# EAGLE design rev1 (EAGLE 9.5.1)
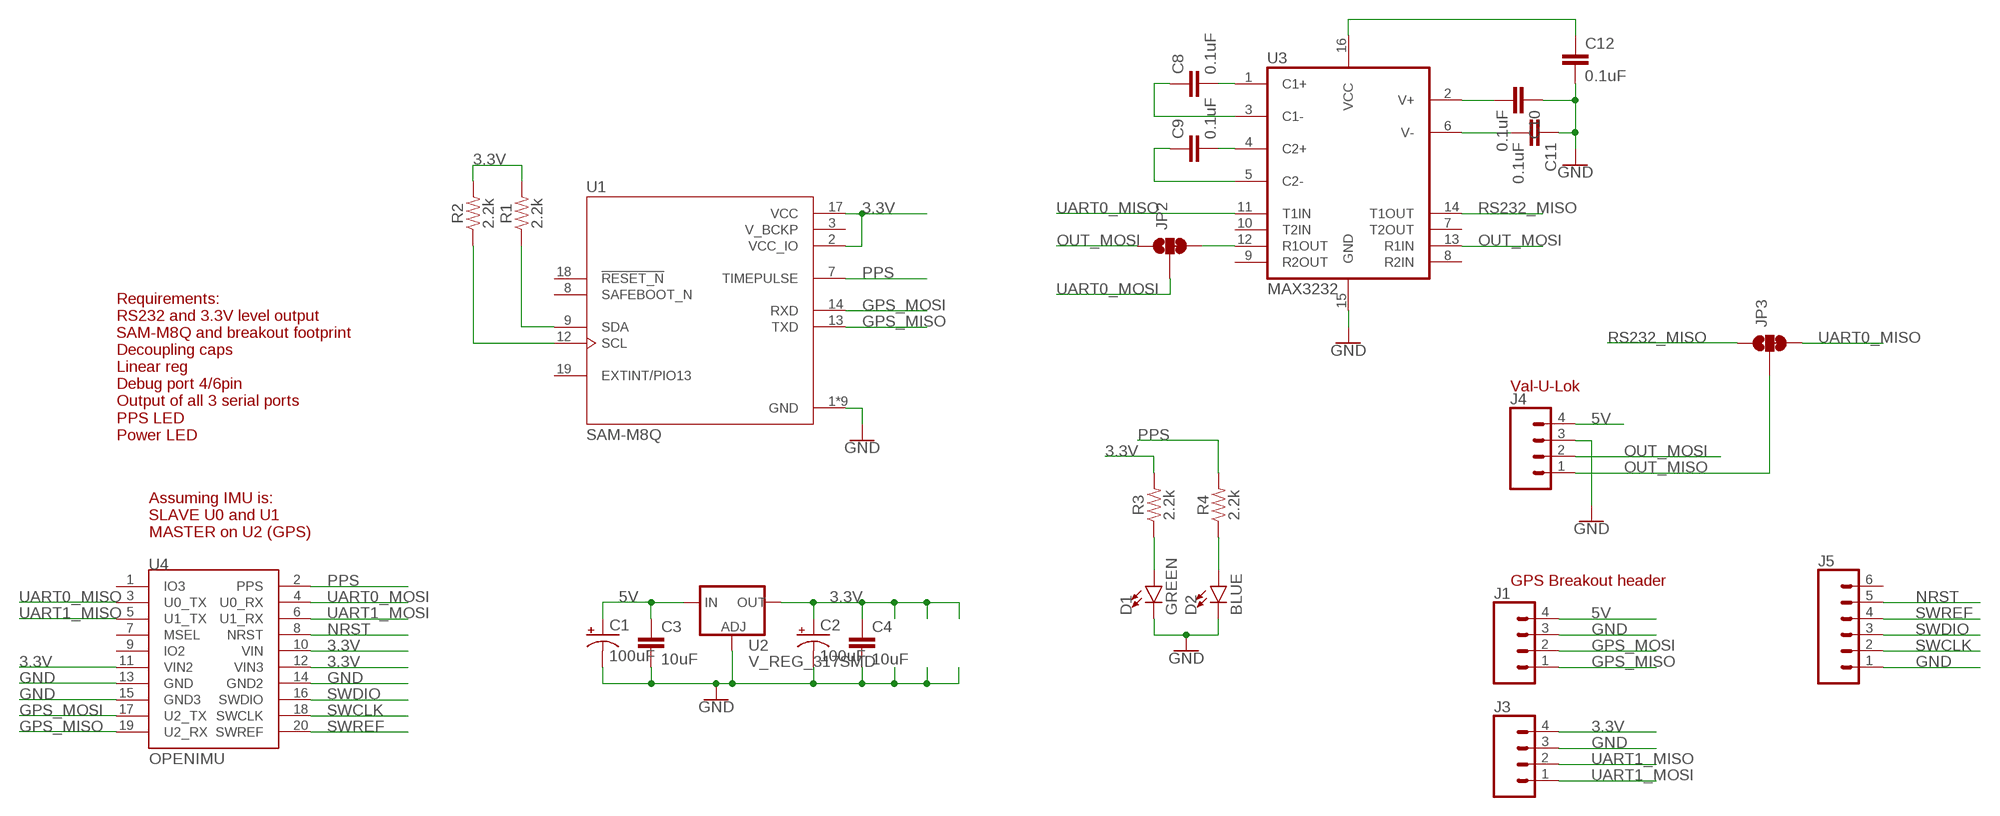
[diagram p0: schematic, sheet 1]

## Parts
C1  100uF  47UF-POLAR-EIA3528-10V-10%  [EIA3528]
C2  100uF  47UF-POLAR-EIA3528-10V-10%  [EIA3528]
C3  10uF  10UF-0805-10V-10%  [0805]
C4  10uF  10UF-0805-10V-10%  [0805]
C8  0.1uF  0.1UF-0603-25V-5%  [0603]
C9  0.1uF  0.1UF-0603-25V-5%  [0603]
C10  0.1uF  0.1UF-0603-25V-5%  [0603]
C11  0.1uF  0.1UF-0603-25V-5%  [0603]
C12  0.1uF  0.1UF-0603-25V-5%  [0603]
D1  GREEN  LED-GREEN0603  [LED-0603]
D2  BLUE  LED-BLUE0603  [LED-0603]
J1  CONN_04  [1X04]
J3  CONN_04  [1X04]
J4  CONN_04POLAR  [MOLEX-1X4]
J5  CONN_06POLAR  [MOLEX-1X6]
JP2  JUMPER-SMT_3_1-NC_TRACE_SILK  [SMT-JUMPER_3_1-NC_TRACE_SILK]
JP3  JUMPER-SMT_3_1-NC_TRACE_SILK  [SMT-JUMPER_3_1-NC_TRACE_SILK]
R1  2.2k  2.2KOHM-0603-1/10W-1%  [0603]
R2  2.2k  2.2KOHM-0603-1/10W-1%  [0603]
R3  2.2k  2.2KOHM-0603-1/10W-1%  [0603]
R4  2.2k  2.2KOHM-0603-1/10W-1%  [0603]
U1  SAM-M8Q  [XCVR_SAM-M8Q]
U2  V_REG_317SMD  [SOT223]
U3  MAX3232  MAX2323TSSOP  [TSSOP16]
U4  OPENIMU  [OPENIMU300ZA]

## Nets
3.3V: C2.A(+) C4.1 J3.4 R1.2 R2.2 R3.2 U1.2(VCC_IO) U1.17(VCC) U2.2(OUT) U4.10(VIN) U4.11(VIN2) U4.12(VIN3)
5V: C1.A(+) C3.1 J1.4 J4.4 U2.3(IN)
GND: C1.C(-) C2.C(-) C3.2 C4.2 C10.1 C11.1 C12.2 D1.C D2.C J1.3 J3.3 J4.3 J5.1 U1.1(GND) U1.4(GND) U1.5(GND) U1.6(GND) U1.10(GND) U1.11(GND) U1.15(GND) U1.16(GND) U1.20(GND) U2.1(ADJ) U3.15(GND) U4.13(GND) U4.14(GND2) U4.15(GND3)
GPS_MISO: J1.1 U1.13(TXD) U4.19(U2_RX)
GPS_MOSI: J1.2 U1.14(RXD) U4.17(U2_TX)
N$1: R1.1 U1.9(SDA)
N$2: R2.1 U1.12(SCL)
N$3: C8.2 U3.1(C1+)
N$4: D1.A R3.1
N$5: C8.1 U3.3(C1-)
N$6: D2.A R4.1
N$7: C9.2 U3.4(C2+)
N$8: C9.1 U3.5(C2-)
N$9: C11.2 U3.6(V-)
N$10: C10.2 U3.2(V+)
N$11: C12.1 U3.16(VCC)
N$15: JP2.3 U3.12(R1OUT)
NRST: J5.5 U4.8(NRST)
OUT_MISO: J4.1 JP3.2
OUT_MOSI: J4.2 JP2.1 U3.13(R1IN)
PPS: R4.2 U1.7(TIMEPULSE) U4.2(PPS)
RS232_MISO: JP3.1 U3.14(T1OUT)
SWCLK: J5.2 U4.18(SWCLK)
SWDIO: J5.3 U4.16(SWDIO)
SWREF: J5.4 U4.20(SWREF)
UART0_MISO: JP3.3 U3.11(T1IN) U4.3(U0_TX)
UART0_MOSI: JP2.2 U4.4(U0_RX)
UART1_MISO: J3.2 U4.5(U1_TX)
UART1_MOSI: J3.1 U4.6(U1_RX)
Unconnected: J5.6 U1.8(SAFEBOOT_N) U1.18(!RESET_N) U1.19(EXTINT/PIO13) U3.7(T2OUT) U3.8(R2IN) U3.9(R2OUT) U3.10(T2IN) U4.1(IO3) U4.7(MSEL) U4.9(IO2)

## Notes on the sheet
- Val-U-Lok
- Requirements:
  RS232 and 3.3V level output
  SAM-M8Q and breakout footprint
  Decoupling caps
  Linear reg
  Debug port 4/6pin
  Output of all 3 serial ports
  PPS LED
  Power LED
- Assuming IMU is:
  SLAVE U0 and U1
  MASTER on U2 (GPS)
- GPS Breakout header

## Power pins joined to a net without a drawn wire
V_BCKP: U1.3(V_BCKP)

## Library data of the parts
C1 C2 = SparkFun-Capacitors:47UF-POLAR: 47µF polarized capacitors A capacitor is a passive two-terminal electrical component used to store electrical energy temporarily in an electric field.; PROD_ID: CAP-08310; VALUE: 47uF
C3 C4 = SparkFun-Capacitors:10UF: 10.0µF ceramic capacitors A capacitor is a passive two-terminal electrical component used to store electrical energy temporarily in an electric field.; PROD_ID: CAP-11330
C8-C12 = SparkFun-Capacitors:0.1UF: 0.1µF ceramic capacitors A capacitor is a passive two-terminal electrical component used to store electrical energy temporarily in an electric field.; PROD_ID: CAP-08604
D1 = SparkFun-LED:LED-GREEN: Green SMD LED Used in manufacturing of various products at SparkFun Packages: 0603 - SMD 0603 package [Product Link] <http://www.futureelectronics.com/en/technologies/semiconductors/optoelectronics/leds/Pages/9894312-LTST-C190GKT.aspx?CrossPart=HSMG-C190&IM=0> LilyPad 1206 - SMD1206 LilyPad package [Product Link] <http://www.futureelectronics.com/en/Technologies/Product.aspx?ProductID=IN150NGHARVATEKCORPORATION2049943&IM=0> 1206 - SMD1206 package [Product Link] <http://www.futureelectronics.com/en/technologies/semiconductors/optoelectronics/leds/Pages/8315665-LTST-C150KGKT.aspx?IM=0> 1206 Bottom Mount -SMD 1206 Bottom Mount [Product Link] <http://www.digikey.com/product-detail/en/lite-on-inc/LTST-C230KGKT/160-1456-1-ND/386854> SparkFun Products: Pro Mini 328 -5V <https://www.sparkfun.com/products/821> RedBoard <https://www.sparkfun.com/products/12757> MP3 Trigger <https://www.sparkfun.com/products/13720> Makey Makey <https://www.sparkfun.com/products/11076>; PROD_ID: DIO-00821
D2 = SparkFun-LED:LED-BLUE: Blue SMD LED Used in manufacturing of various products at SparkFun Packages: 0603 - SMD 0603 package [Product Link] <http://www.digikey.com/product-detail/en/SMLE12BC7TT86/511-1589-2-ND/1641808> 1206 - SMD1206 package [Product Link] <http://www.digikey.com/product-detail/en/lite-on-inc/LTST-C150TBKT/160-1643-1-ND/573584> SparkFun Products: ESP8266 Thing-Dev Board <https://www.sparkfun.com/products/13711> RedBoard <https://www.sparkfun.com/products/12757>; PROD_ID: DIO-08575
J1 J3 = SparkFun-Connectors:CONN_04: Multi connection point. Often used as Generic Header-pin footprint for 0.1 inch spaced/style header connections On any of the 0.1 inch spaced packages, you can populate with these: Break Away Headers - Straight <https://www.sparkfun.com/products/116> (PRT-00116) Break Away Male Headers - Right Angle <https://www.sparkfun.com/products/553> (PRT-00553) Female Headers <https://www.sparkfun.com/products/115> (PRT-00115) Break Away Headers - Machine Pin <https://www.sparkfun.com/products/117> (PRT-00117) Break Away Female Headers - Swiss Machine Pin <https://www.sparkfun.com/products/743> (PRT-00743) For SCREWTERMINALS and SPRING TERMINALS visit here: Screw Terimnals on SparkFun.com <https://www.sparkfun.com/search/results?term=Screw+Terminals> (5mm/3.5mm/2.54mm spacing) This device is also useful as a general connection point to wire up your design to another part of your project. Our various solder wires solder well into these plated through hole pads. Hook-Up Wire - Assortment (Stranded, 22 AWG) <https://www.sparkfun.com/products/11375> (PRT-11375) Hook-Up Wire - Assortment (Solid Core, 22 AWG) <https://www.sparkfun.com/products/11367> (PRT-11367) View the entire wire category on our website here <https://www.sparkfun.com/categories/141> Special notes: Molex polarized connector foot print use with SKU : PRT-08231 with associated crimp pins and housings. 1MM SMD Version SKU: PRT-10208; PROD_ID: CONN-09696
J4 = SparkFun-Connectors:CONN_04: Multi connection point. Often used as Generic Header-pin footprint for 0.1 inch spaced/style header connections On any of the 0.1 inch spaced packages, you can populate with these: Break Away Headers - Straight <https://www.sparkfun.com/products/116> (PRT-00116) Break Away Male Headers - Right Angle <https://www.sparkfun.com/products/553> (PRT-00553) Female Headers <https://www.sparkfun.com/products/115> (PRT-00115) Break Away Headers - Machine Pin <https://www.sparkfun.com/products/117> (PRT-00117) Break Away Female Headers - Swiss Machine Pin <https://www.sparkfun.com/products/743> (PRT-00743) For SCREWTERMINALS and SPRING TERMINALS visit here: Screw Terimnals on SparkFun.com <https://www.sparkfun.com/search/results?term=Screw+Terminals> (5mm/3.5mm/2.54mm spacing) This device is also useful as a general connection point to wire up your design to another part of your project. Our various solder wires solder well into these plated through hole pads. Hook-Up Wire - Assortment (Stranded, 22 AWG) <https://www.sparkfun.com/products/11375> (PRT-11375) Hook-Up Wire - Assortment (Solid Core, 22 AWG) <https://www.sparkfun.com/products/11367> (PRT-11367) View the entire wire category on our website here <https://www.sparkfun.com/categories/141> Special notes: Molex polarized connector foot print use with SKU : PRT-08231 with associated crimp pins and housings. 1MM SMD Version SKU: PRT-10208; PROD_ID: CONN-08186; SF_ID: PRT-08231
J5 = SparkFun-Connectors:CONN_06: Multi connection point. Often used as Generic Header-pin footprint for 0.1 inch spaced/style header connections On any of the 0.1 inch spaced packages, you can populate with these: Break Away Headers - Straight <https://www.sparkfun.com/products/116> (PRT-00116) Break Away Male Headers - Right Angle <https://www.sparkfun.com/products/553> (PRT-00553) Female Headers <https://www.sparkfun.com/products/115> (PRT-00115) Break Away Headers - Machine Pin <https://www.sparkfun.com/products/117> (PRT-00117) Break Away Female Headers - Swiss Machine Pin <https://www.sparkfun.com/products/743> (PRT-00743) Arduino Stackable Header - 6 Pin <https://www.sparkfun.com/products/9280> (PRT-09280) For SCREWTERMINALS and SPRING TERMINALS visit here: Screw Terimnals on SparkFun.com <https://www.sparkfun.com/search/results?term=Screw+Terminals> (5mm/3.5mm/2.54mm spacing) This device is also useful as a general connection point to wire up your design to another part of your project. Our various solder wires solder well into these plated through hole pads. Hook-Up Wire - Assortment (Stranded, 22 AWG) <https://www.sparkfun.com/products/11375> (PRT-11375) Hook-Up Wire - Assortment (Solid Core, 22 AWG) <https://www.sparkfun.com/products/11367> (PRT-11367) View the entire wire category on our website here <https://www.sparkfun.com/categories/141>
JP2 JP3 = SparkFun-Jumpers:JUMPER-SMT_3_1-NC_TRACE: Normally closed trace jumper (1 of 2 connections) This jumper has a trace between two pads so it's normally closed (NC). The other connection is normally open (NO). Use a razor knife to open the connection. For best results follow the IPC guidelines for cutting traces: Cutout at least 0.063 mm (0.005 in). Remove all loose material to clean up the cut area. Seal the cut with an approved epoxy. Reapply solder to reclose the connection, or to close the NO connection.
R1-R4 = SparkFun-Resistors:2.2KOHM: 2.2kΩ resistor A resistor is a passive two-terminal electrical component that implements electrical resistance as a circuit element. Resistors act to reduce current flow, and, at the same time, act to lower voltage levels within circuits. - Wikipedia; PROD_ID: RES-08272
U1 = SAM-M8Q:SAM-M8Q: u-blox SAM GNSS antenna module; AVAILABILITY: Unavailable; DESCRIPTION: SAM-M8Q RF Receiver Galileo, GLONASS, GPS 1.575GHz, 1.602GHz -165dBm 400kbps; MF: U-Blox America; MP: SAM-M8Q; PACKAGE: SMD-20 U-Blox America; PRICE: None
U2 = SparkFun-IC-Power:V_REG_317: Voltage Regulator Standard LM317 adjustable voltage regulator. AOI (Adjust Output Input). Google 'LM317 Calculator' for easy to use app to get the two resistor values needed. 240/720 for 5V output. 240/390 for 3.3V output. Spark Fun Electronics SKU : COM-00527
U3 = SparkFun-IC-Comms:MAX2323: RS232 Transceiver This part covers 232 drivers that are compatible with the MAX3232. Sipex SP3232EB Datasheet <http://cdn.sparkfun.com/datasheets/Components/General%20IC/SP3232EBCA-L.pdf> SparkFun Products SOIC component <https://www.sparkfun.com/products/589> (COM-00589 / IC-08171) Retired DIP component (COM-00316 / IC-08446) SparkFun Transceiver Breakout - MAX3232 <https://www.sparkfun.com/products/11189> (BOB-11189) SparkFun XBee Explorer Serial <https://www.sparkfun.com/products/13225> (WRL-13225); PROD_ID: NA-XXXXX
U4 = 2020:OPENIMU

## Board
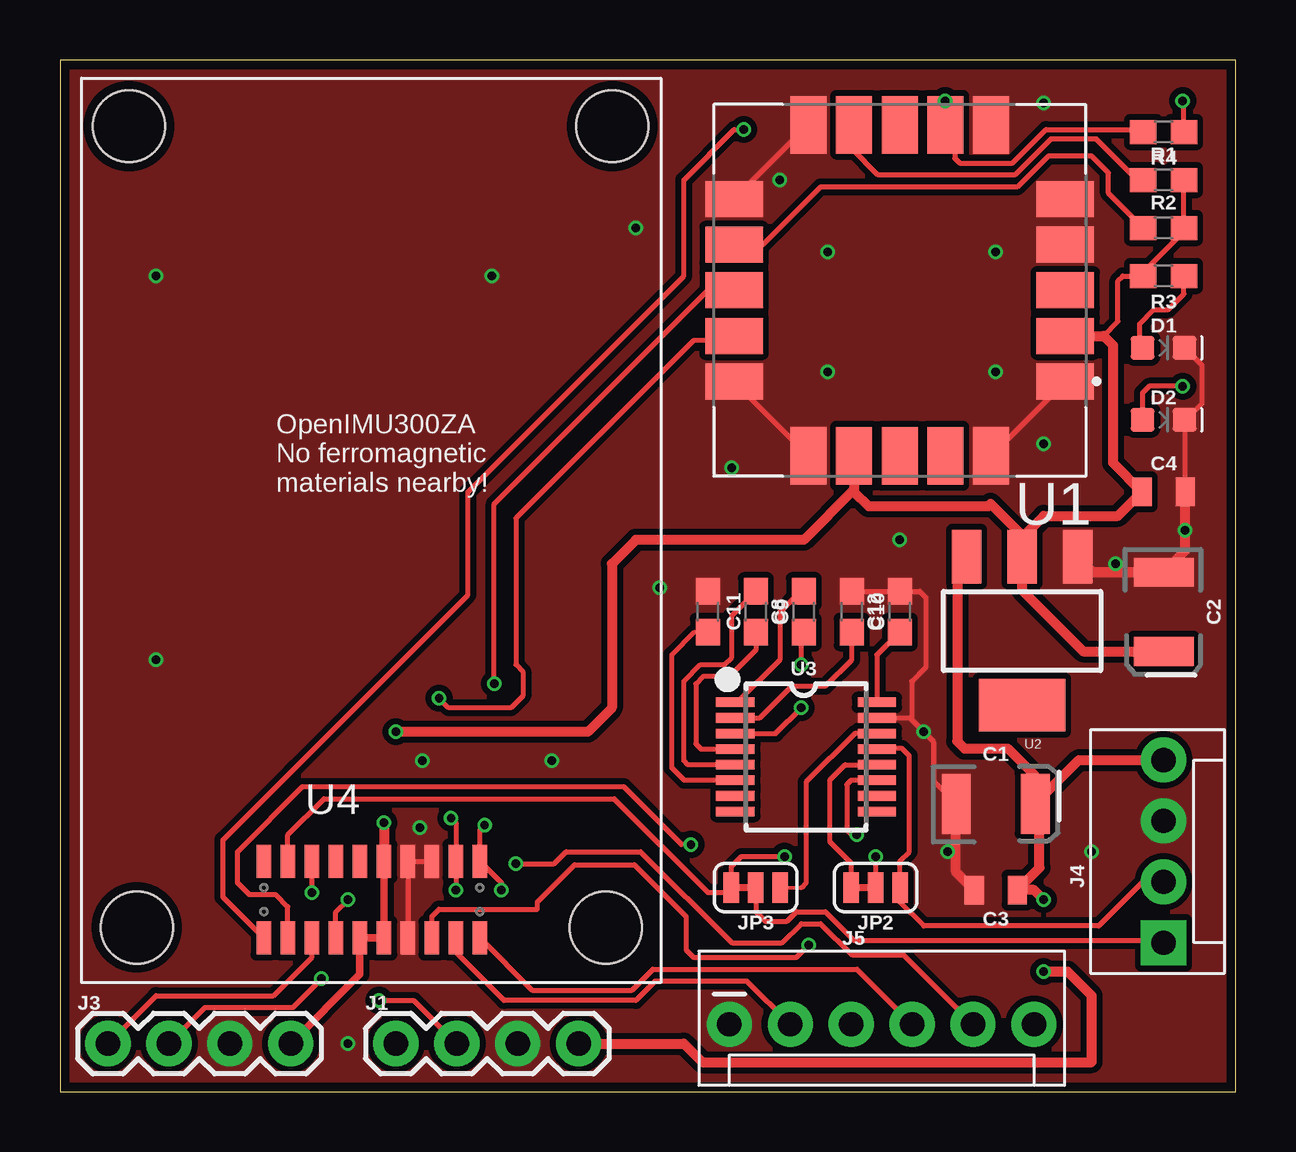
[diagram p1: board, top side]
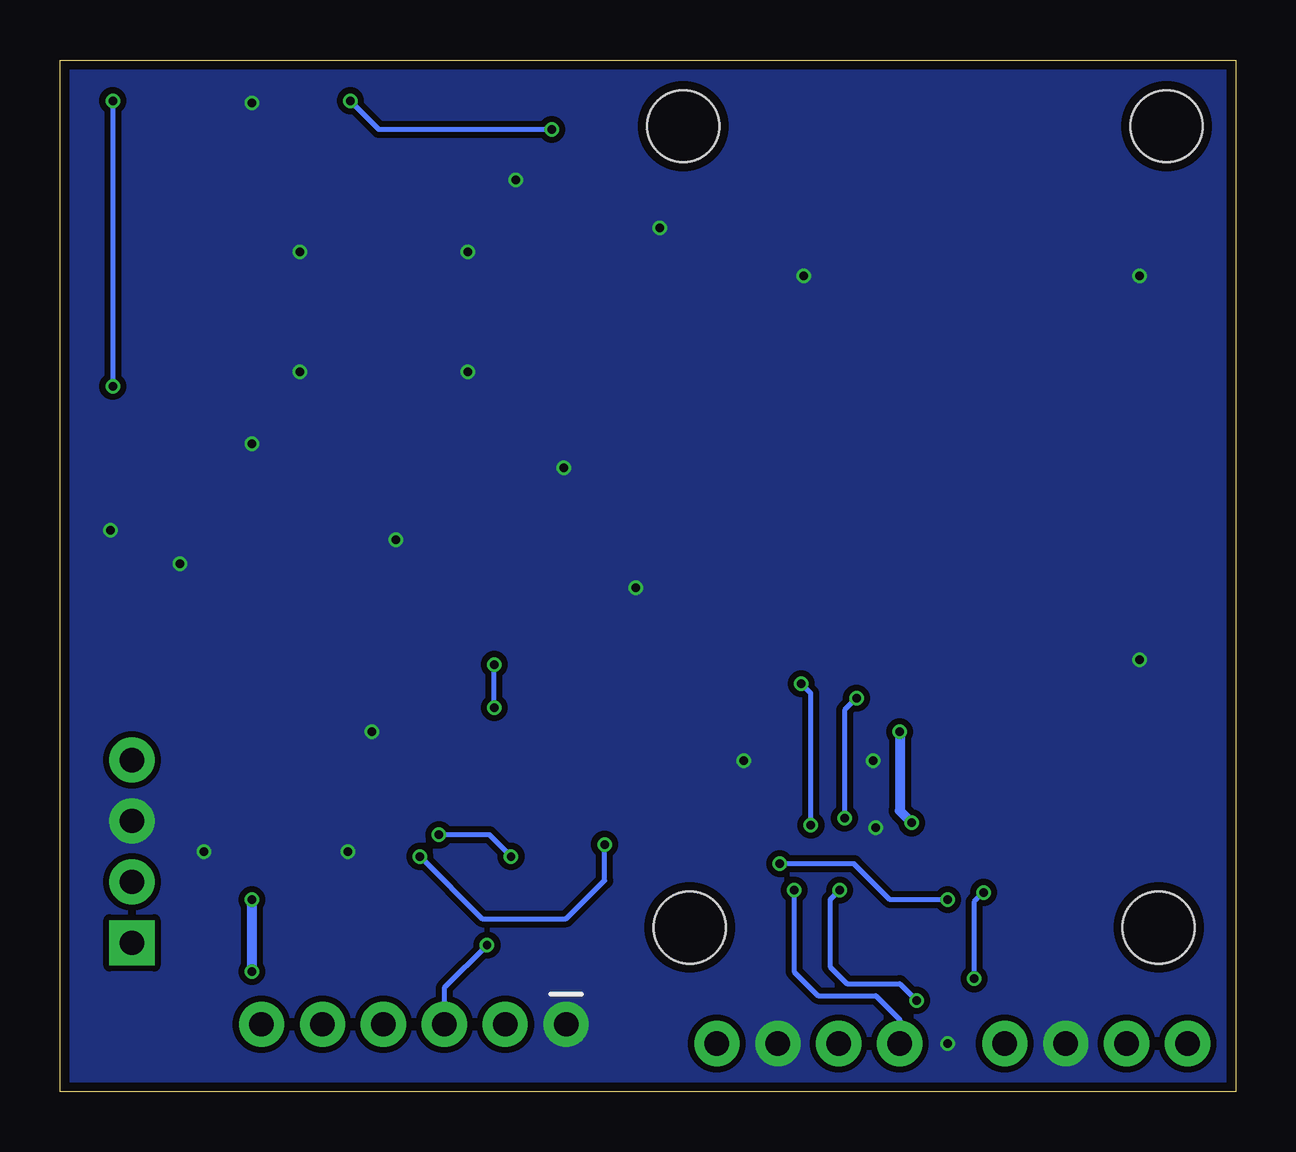
[diagram p2: board, bottom side, seen from below]

Size 49 x 43 mm. Coordinates in mm from the lower left corner, seen from the top.
Outline: 0,0 49,0 49,43 0,43 0,0
Copper layers (1*16): Top 0.035559375mm / dielectric 1.6mm / Bottom 0.035559375mm
Design rules "PATRICK-2lyr": minimum track width 6mil, minimum drill 10mil, track to track 6mil, track to pad 6mil, pad to pad 6mil, via to via 6mil, smd to smd 6mil, copper to edge 15mil, drill to drill 6mil, minimum pad ring 5mil, minimum via ring 5mil, stop-mask expansion 2.5mil, vias tented up to drill 25mil, thermal gap 10mil

### Footprints (pad centres in the part's own frame; a part is rotated, then mirrored left to right if it is on the bottom)
EIA3528 = smd 1.2 x 2.5: A 1.65,0; C -1.65,0
0805 = smd 0.8 x 1.2: 1 -0.9,0; 2 0.9,0
0603 = smd 1.1 x 1: 1 -0.85,0; 2 0.85,0
LED-0603 = smd 1 x 1: A -0.877,0; C 0.877,0
1X04 = drill 1.016 pad 1.88: 1 0,0; 2 2.54,0; 3 5.08,0; 4 7.62,0
MOLEX-1X4 = drill 1.016 pad 1.88 square: 1 0,0 | drill 1.016 pad 1.88: 2 2.54,0; 3 5.08,0; 4 7.62,0
MOLEX-1X6 = drill 1.016 pad 1.88: 1 0,0; 2 2.54,0; 3 5.08,0; 4 7.62,0; 5 10.16,0; 6 12.7,0
SMT-JUMPER_3_1-NC_TRACE_SILK = smd 0.635 x 1.27: 1 -1.016,0; 2 0,0; 3 1.016,0
XCVR_SAM-M8Q = smd 2.4 x 1.5: 1 -6.9,3.8; 2 -6.9,1.9; 3 -6.9,0; 4 -6.9,-1.9; 5 -6.9,-3.8; 11 6.9,-3.8; 12 6.9,-1.9; 13 6.9,0; 14 6.9,1.9; 15 6.9,3.8 | smd 1.5 x 2.4: 6 -3.8,-6.9; 7 -1.9,-6.9; 8 0,-6.9; 9 1.9,-6.9; 10 3.8,-6.9; 16 3.8,6.9; 17 1.9,6.9; 18 0,6.9; 19 -1.9,6.9; 20 -3.8,6.9
SOT223 = smd 1.219 x 2.235: 1 -2.311,-3.099; 2 0,-3.099; 3 2.311,-3.099 | smd 3.6 x 2.2: 4 0,3.099
TSSOP16 = smd 0.4 x 1.6: 1 -2.225,-2.85; 2 -1.575,-2.85; 3 -0.925,-2.85; 4 -0.275,-2.85; 5 0.375,-2.85; 6 1.025,-2.85; 7 1.675,-2.85; 8 2.325,-2.85; 9 2.325,3.05; 10 1.675,3.05; 11 1.025,3.05; 12 0.375,3.05; 13 -0.275,3.05; 14 -0.925,3.05; 15 -1.575,3.05; 16 -2.225,3.05
OPENIMU300ZA = smd 0.61 x 1.372: 1 -4.503,1.6; 2 -4.503,-1.6; 3 -3.503,1.6; 4 -3.503,-1.6; 5 -2.502,1.6; 6 -2.502,-1.6; 7 -1.501,1.6; 8 -1.501,-1.6; 9 -0.5,1.6; 10 -0.5,-1.6; 11 0.5,1.6; 12 0.5,-1.6; 13 1.501,1.6; 14 1.501,-1.6; 15 2.502,1.6; 16 2.502,-1.6; 17 3.503,1.6; 18 3.503,-1.6; 19 4.503,1.6; 20 4.503,-1.6 | hole 3: 9.75,-1.16; -9.8,-1.16; -10.125,32.24; 10.025,32.24

### Placement (x,y rotation side)
C1  39,12 0 top
C2  46,20 270 top
C3  39,8.4 180 top
C4  46,25 0 top
C8  31,20 90 top
C9  29,20 270 top
C10  33,20 270 top
C11  27,20 270 top
C12  35,20 90 top
D1  46,31 0 top
D2  46,28 0 top
J1  14,2 0 top
J3  2,2 0 top
J4  46,6.2 90 top
J5  27.9,2.8 0 top
JP2  34,8.5 180 top
JP3  29,8.5 180 top
R1  46,38 0 top
R2  46,36 0 top
R3  46,34 180 top
R4  46,40 180 top
U1  35,33.4 180 top
U2  40.1,19.2 180 top
U3  31,14 270 top
U4  13,8 0 top

### Tracks (layer width: path | path; a pad name or v marks a point on that pad's centre or on a via)
3.3V  (via drill 0.35)
  Top 0.203: 43.5,31.5 44.1,32.1 44.1,33.8 44.3,34 R3.2 45.15,34.15 46.85,35.85 R2.2 R1.2
  Top 0.305: U4.11 U4.12 U4.10 12.5,4.88 J3.4
  Top 0.406: U2.2 40.1,20.9 42.65,18.35 C2.A | U2.2 40.1,23.1 41,24 44.1,24 C4.1 43.9,26.2 43.9,31.1 43.5,31.5 U1.2 | U2.2 40.1,23.2 38.8,24.5 38.7,24.4 33.7,24.4 33.1,25 U1.17 33.1,25.1 31,23 24,23 23,22 23,16 22,15 v14,15 | v13.5,11.2 | v13.5,11.2 U4.11
  Bottom 0.406: v14,15 14,11.7 v13.5,11.2
5V  (via drill 0.35)
  Top 0.406: 40.83,12.18 C1.A 40.65,13.15 39.5,14.3 37.7,14.3 37.4,14.6 37.4,21.91 U2.3 | 40.83,12.18 42.47,13.82 J4.4 | 40.83,12.18 40.83,9.32 C3.1 40.6,8.4 v41,8 | J1.4 26,2 26.78,1.22 43,1.22 43,4 42,5 v41,5
  Bottom 0.406: v41,5 v41,8
GND  (via drill 0.35)
  Top 0.203: U4.14 U4.13 U4.15 | C10.1 C12.2 35.85,20.85 36.1,20.6 36.1,17.7 35.5,17.1 35.5,15.5 | U3.15 35.42,15.57 35.5,15.5 | C1.C 36.4,12.95 36.4,14.6 v36,15 35.5,15.5 | C4.2 46.9,27.98 | 46.9,27.98 D2.C | D1.C 47.6,30.28 47.6,28.68 46.9,27.98 | U1.11 U1.10 | U1.15 U1.16 | U1.20 U1.1
  Top 0.406: C3.2 37.35,9.15 C1.C | C4.2 v46.9,23.4 46.9,22.55 C2.C 43.06,21.65 U2.1
  other vias: 28,26 32,30 32,35 39,35 39,30 41,27 41,41.2 24,36 30,38 35,23 25,21 37,10 43,10 44,22 4,34 18,34 4,18 15.1,13.8 20.5,13.8 15,11 12,2
  pour Top (isolate 0.254, no thermals): 0,43 49,43 49,0 0,0
  pour Bottom (isolate 0.254, no thermals): -1,44 -1,-1 50,-1 50,44
GPS_MISO  (via drill 0.35)
  Top 0.203: v18.4,8.4 18.4,8.7 U4.19 17.5,10.9 v17.7,11.1 | v18.1,17 18.1,24.5 27,33.4 U1.13
  Bottom 0.203: v18.4,8.4 18.4,5 17.4,4 15,4 14,3 J1.1 | v17.7,11.1 17.7,16.6 v18.1,17
GPS_MOSI  (via drill 0.35)
  Top 0.203: v16.5,8.4 U4.17 16.5,11.2 v16.3,11.4 | v13.3,3.8 14.74,3.8 J1.2 | U1.14 27.9,31.3 26.4,31.3 19,23.9 19,17.8 19.3,17.5 19.3,16.5 18.8,16 16.2,16 v15.8,16.4
  Bottom 0.203: v16.5,8.4 16.9,8 16.9,5.2 16.2,4.5 14,4.5 v13.3,3.8 | v15.8,16.4 16.3,15.9 v16.3,11.4
N$1
  Top 0.203: R1.1 44.9,38 43.2,39.7 41.3,39.7 39.8,38.2 34.1,38.2 33,39.3 33,40.2 U1.9
N$2
  Top 0.203: R2.1 43.7,37.45 43.7,38.3 43,39 41.2,39 39.9,37.7 31.7,37.7 29.3,35.3 U1.12
N$3
  Top 0.203: C8.2 30.85,20.85 30,20 30,18 28.23,16.23 U3.1
N$4
  Top 0.203: D1.A 45,31.12 45,32 45.6,32.6 46.2,32.6 46.85,33.25 R3.1
N$5  (via drill 0.35)
  Top 0.203: U3.3 29.82,14.93 v30.9,16 | v30.9,17.8 30.9,19.05 C8.1
  Bottom 0.203: v30.9,16 v30.9,17.8
N$6  (via drill 0.35)
  Top 0.203: R4.1 46.85,41.25 v46.8,41.3 | v46.8,29.4 45.4,29.4 45.12,29.12 D2.A
  Bottom 0.203: v46.8,41.3 v46.8,29.4
N$7
  Top 0.203: C9.2 29,18.4 27.9,17.3 26.8,17.3 26.5,17 26.5,14.5 26.73,14.28 U3.4
N$8
  Top 0.203: U3.5 26.18,13.62 26,13.8 26,17.1 26.7,17.8 27.7,17.8 28,18.1 28,19.85 C9.1
N$9
  Top 0.203: U3.6 26.02,12.97 25.5,13.5 25.5,18.2 26.45,19.15 C11.2
N$10
  Top 0.203: U3.2 29.18,15.57 30.5,16.9 31.9,16.9 33,18 C10.2
N$11
  Top 0.203: C12.1 34.05,18.2 U3.16
N$15
  Top 0.203: JP2.3 32.98,9.52 32.1,10.4 32.1,13 32.73,13.62 U3.12
NRST  (via drill 0.35)
  Top 0.203: U4.8 11.5,7.5 v12,8 | v19,9.5 20.6,9.5 21.1,10 24.2,10 28,6.2 30.1,6.2 30.9,7 31.7,7 33,5.7 35.16,5.7 J5.5
  Bottom 0.203: v12,8 14.4,8 15.9,9.5 v19,9.5
OUT_MISO
  Top 0.203: JP3.2 29,7.5 29.4,7.1 30.3,7.1 30.7,7.5 31.9,7.5 33.1,6.3 45.9,6.3 J4.1
OUT_MOSI
  Top 0.203: J4.2 45.14,8.74 43.3,6.9 36,6.9 35.02,7.88 JP2.1 35.02,9.62 35.4,10 35.4,14 35.1,14.3 34.08,14.3 U3.13
PPS  (via drill 0.35)
  Top 0.203: U4.2 6.8,8.1 6.8,10.5 9.65,13.35 9.8,13.5 17,20.7 17,25 26,34 26,38 28.1,40.1 v28.5,40.1 | R4.2 45.05,40.1 41.1,40.1 39.7,38.7 37.5,38.7 37.3,38.9 37.3,39.9 U1.7 v36.9,41.3
  Bottom 0.203: v28.5,40.1 35.7,40.1 v36.9,41.3
RS232_MISO
  Top 0.152: 30.9,8.5 JP3.1
  Top 0.203: U3.14 33.12,14.93 31.1,12.9 31.1,8.7 30.9,8.5
SWCLK
  Top 0.203: J5.2 28.64,4.6 24.8,4.6 24,3.8 18.5,3.8 16.5,5.8 U4.18
SWDIO  (via drill 0.35)
  Top 0.203: U4.16 15.5,7.3 15.8,7.6 19.9,7.6 19.9,7.9 21.46,9.46 23.94,9.46 26.1,7.3 26.1,5.9 26.4,5.6 30.7,5.6 v31.2,6.1
  Bottom 0.203: v31.2,6.1 32.98,4.32 J5.3
SWREF
  Top 0.203: U4.20 19.68,4.22 23.83,4.22 24.71,5.1 33.22,5.1 J5.4
UART0_MISO  (via drill 0.35)
  Top 0.203: U4.3 9.5,10.7 11,12.2 23.1,12.2 27,8.3 27.78,8.3 JP3.3 27.98,9.38 28.4,9.8 v30.2,9.8 | U3.11 32.98,12.97 32.8,12.8 32.8,10.9 33,10.7 v33.2,10.7
  Bottom 0.203: v30.2,9.8 31.1,10.7 v33.2,10.7
UART0_MOSI  (via drill 0.35)
  Top 0.203: U4.4 9.5,7.7 9,8.2 7.9,8.2 7.4,8.7 7.4,10 10.1,12.7 23.5,12.7 25.9,10.3 v26.3,10.3 | JP2.2 v34,9.8
  Bottom 0.203: v34,9.8 31.4,7.2 27.9,7.2 26.3,8.8 v26.3,10.3
UART1_MISO  (via drill 0.35)
  Top 0.203: U4.5 v10.5,8.3 | v10.9,4.7 9.7,3.5 6.04,3.5 J3.2
  Bottom 0.203: v10.5,8.3 10.9,7.9 v10.9,4.7
UART1_MOSI
  Top 0.203: J3.1 4,4 8.9,4 10.5,5.6 U4.6